# Altium project 电子脚铐手持式主控板.PrjPcb
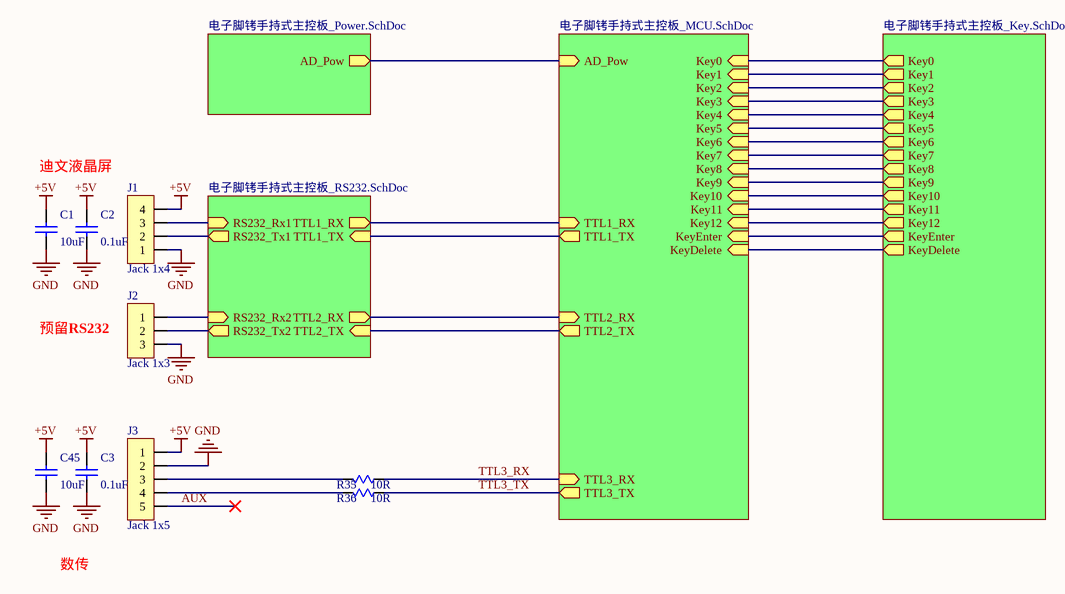
[diagram p0: 电子脚铐手持式主控板_Frame.SchDoc]
5 sheets, 124 parts. Net scope: hierarchical (ports join the sheet entries above them; power ports are global).
Board file: 电子脚铐手持式主控板V3.PcbDoc
Sheets:
  电子脚铐手持式主控板_Frame.SchDoc
    Designator = 电子脚铐手持式主控板_Power.SchDoc
    Designator = 电子脚铐手持式主控板_RS232.SchDoc
    Designator = 电子脚铐手持式主控板_Key.SchDoc
    Designator = 电子脚铐手持式主控板_MCU.SchDoc

## Sheet 电子脚铐手持式主控板_Frame.SchDoc
size A4

### Parts
C1  10uF  [C0603]
C2  0.1uF  [C0603]
C3  0.1uF  [C0603]
C45  10uF  [C0603]
J1  Jack 1x4  [XH-4AW]
J2  Jack 1x3  [XH-3AW]
J3  Jack 1x5  [PH-5A]
R35  10R  [R0603]
R36  10R  [R0603]

### Sub-sheets
Designator = 电子脚铐手持式主控板_Power.SchDoc: AD_Pow (out)
Designator = 电子脚铐手持式主控板_RS232.SchDoc: RS232_Tx1 (out), RS232_Rx1 (in), RS232_Rx2 (in), RS232_Tx2 (out), TTL1_RX (out), TTL2_RX (out), TTL1_TX (in), TTL2_TX (in)
Designator = 电子脚铐手持式主控板_Key.SchDoc: Key0 (out), Key1 (out), Key2 (out), Key3 (out), Key4 (out), Key5 (out), Key6 (out), Key7 (out), Key8 (out), Key9 (out), KeyEnter (out), KeyDelete (out), Key10 (out), Key11 (out), Key12 (out)
Designator = 电子脚铐手持式主控板_MCU.SchDoc: AD_Pow (in), TTL1_RX (in), TTL1_TX (out), TTL2_TX (out), TTL2_RX (in), Key0 (in), Key1 (in), Key2 (in), Key3 (in), Key4 (in), Key5 (in), Key6 (in), Key7 (in), Key8 (in), Key9 (in), KeyEnter (in), KeyDelete (in), TTL3_RX (in), TTL3_TX (out), Key10 (in), Key11 (in), Key12 (in)

### Nets
+5V: C1.1 C2.1 C3.1 C45.1 J1.4 J3.1
GND: C1.2 C2.2 C3.2 C45.2 J1.1 J2.3 J3.2
AD_Pow: sheet Designator/AD_Pow, sheet Designator/AD_Pow
AUX: J3.5
Key0: sheet Designator/Key0, sheet Designator/Key0
Key1: sheet Designator/Key1, sheet Designator/Key1
Key2: sheet Designator/Key2, sheet Designator/Key2
Key3: sheet Designator/Key3, sheet Designator/Key3
Key4: sheet Designator/Key4, sheet Designator/Key4
Key5: sheet Designator/Key5, sheet Designator/Key5
Key6: sheet Designator/Key6, sheet Designator/Key6
Key7: sheet Designator/Key7, sheet Designator/Key7
Key8: sheet Designator/Key8, sheet Designator/Key8
Key9: sheet Designator/Key9, sheet Designator/Key9
Key10: sheet Designator/Key10, sheet Designator/Key10
Key11: sheet Designator/Key11, sheet Designator/Key11
Key12: sheet Designator/Key12, sheet Designator/Key12
KeyDelete: sheet Designator/KeyDelete, sheet Designator/KeyDelete
KeyEnter: sheet Designator/KeyEnter, sheet Designator/KeyEnter
RS232_Rx1: J1.3 ; sheet Designator/RS232_Rx1
RS232_Rx2: J2.1 ; sheet Designator/RS232_Rx2
RS232_Tx1: J1.2 ; sheet Designator/RS232_Tx1
RS232_Tx2: J2.2 ; sheet Designator/RS232_Tx2
TTL1_RX: sheet Designator/TTL1_RX, sheet Designator/TTL1_RX
TTL1_TX: sheet Designator/TTL1_TX, sheet Designator/TTL1_TX
TTL2_RX: sheet Designator/TTL2_RX, sheet Designator/TTL2_RX
TTL2_TX: sheet Designator/TTL2_TX, sheet Designator/TTL2_TX
TTL3_RX: R35.2 ; sheet Designator/TTL3_RX
TTL3_TX: R36.2 ; sheet Designator/TTL3_TX
NetJ3_3: J3.3 R35.1
NetJ3_4: J3.4 R36.1

### Notes on the sheet
- 迪文液晶屏
- 预留RS232
- 数传
- 文件名:
- 审核:
- 制图人:
- 孟浩
- 校对:
- 图号:
- 批准:
- 日期:

### Library data of the parts
C1-C3 C45 = CAP: Published: 8-Jun-2000; LatestRevisionDate: 17-Jul-2002; LatestRevisionNote: Re-released for DXP Platform.; PackageReference: RAD-0.3; Publisher: Altium Limited
J1 = Jack 1x4: 插座
J2 = Jack 1x3: 插座
J3 = Jack 1x5: 插座
R35 R36 = Res: Resistor; Published: 8-Jun-2000; LatestRevisionDate: 04-Mar-2005; LatestRevisionNote: PCB Footprint replaced.; PackageReference: J1-0603; Publisher: Altium Limited

## Sheet 电子脚铐手持式主控板_Power.SchDoc
size A4
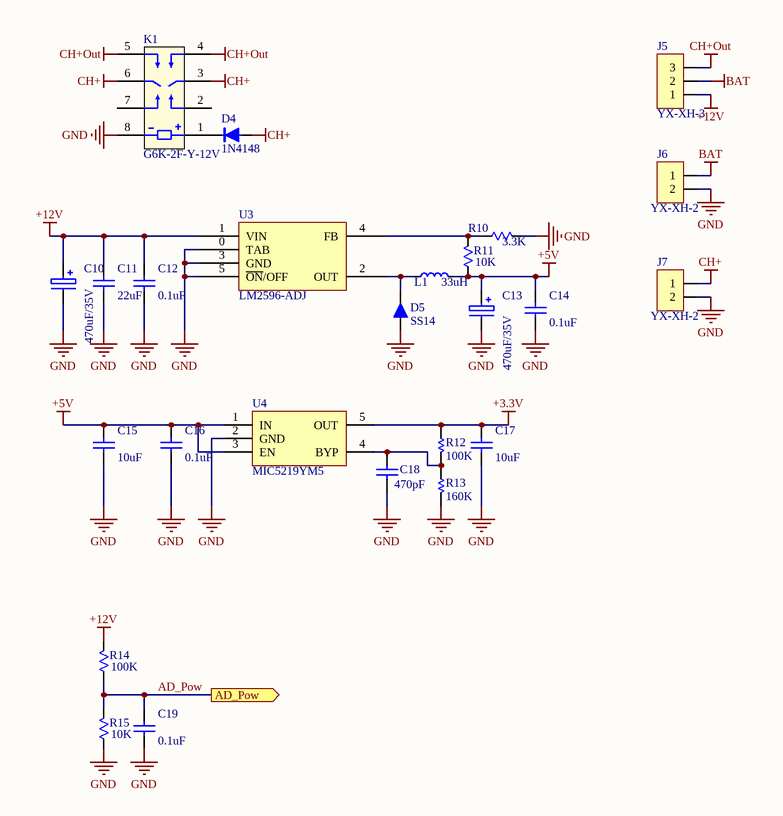
[diagram p1: 电子脚铐手持式主控板_Power.SchDoc]

### Parts
C10  470uF/35V  [C10*10.8]
C11  22uF  [C1210]
C12  0.1uF  [C0603]
C13  470uF/35V  [C10*10.8]
C14  0.1uF  [C0603]
C15  10uF  [C0603]
C16  0.1uF  [C0603]
C17  10uF  [C0603]
C18  470pF  [C0603]
C19  0.1uF  [C0603]
D4  1N4148  [SOD-80-S]
D5  SS14  [SMA]
J5  YX-XH-3  [YX-XH-3]
J6  YX-XH-2  [YX-XH-2]
J7  YX-XH-2  [YX-XH-2]
K1  G6K-2F-Y-12V  [G6K-2F-Y]
L1  33uH  [L10.5*11.5mm]
R10  3.3K  [R0603]
R11  10K  [R0603]
R12  100K  [R0603]
R13  160K  [R0603]
R14  100K  [R0603]
R15  10K  [R0603]
U3  LM2596-ADJ  [TO-263-5]
U4  MIC5219YM5  [SOT-23-5]

### Ports
AD_Pow (out)

### Nets
+3.3V: C17.1 R12.1 U4.5(OUT)
+5V: C13.1 C14.1 C15.1 C16.1 L1.2 R11.1 U4.1(IN) U4.3(EN)
+12V: C10.1 C11.1 C12.1 J5.1 R14.2 U3.1(VIN)
BAT: J5.2 J6.1
CH+: D4.1(A) J7.1 K1.3 K1.6
CH+Out: J5.3 K1.4 K1.5
GND: C10.2 C11.2 C12.2 C13.2 C14.2 C15.2 C16.2 C17.2 C18.2 C19.2 D5.1(A) J6.2 J7.2 K1.8 R10.2 R13.2 R15.1 U3.0(TAB) U3.3(GND) U3.5(~{ON}/OFF) U4.2(GND)
AD_Pow: C19.1 R14.1 R15.2 ; port AD_Pow
NetC18_1: C18.1 R12.2 R13.1 U4.4(BYP)
NetD4_2: D4.2(K) K1.1
NetD5_2: D5.2(K) L1.1 U3.2(OUT)
NetR10_1: R10.1 R11.2 U3.4(FB)

Not connected (* = marked no-connect by the designer): K1 2 7

### Notes on the sheet
- 文件名:
- 审核:
- 制图人:
- 孟浩
- 校对:
- 图号:
- 批准:
- 日期:

### Library data of the parts
C10 C13 = ELECTRO: Electrolytic Capacitor
C11 C12 C14-C19 = CAP: Published: 8-Jun-2000; LatestRevisionDate: 17-Jul-2002; LatestRevisionNote: Re-released for DXP Platform.; PackageReference: RAD-0.3; Publisher: Altium Limited
D4 = DIODE-SWITCHING: Silicon Epitaxial Planar Diodes
D5 = Diode 1N4148: High Conductance Fast Diode; Published: 8-Jun-2000; LatestRevisionDate: 17-Jul-2002; LatestRevisionNote: Re-released for DXP Platform.; DatasheetVersion: 1997; PackageReference: DO-35; Publisher: Altium Limited; PackageDescription: Diode, Axial; Body 3.8 x 1.9 mm (LxDia. max), Lead Dia. 0.53 mm (max); Code_JEDEC: DO-204-AH; ComponentLink1Description: Manufacturer Link; ComponentLink1URL: http://www.fairchildsemi.com/; ComponentLink2Description: Datasheet; ComponentLink2URL: http://www.fairchildsemi.com/ds/1N%2F1N4148.pdf
J5 = HEADER1X3
J6 J7 = Jack 1x2: 插座
K1 = G6K-2F-Y
L1 = INDUCTOR: Code_IEC: 1005; Published: 8-Jun-2000; LatestRevisionDate: 17-Jul-2002; LatestRevisionNote: Re-released for DXP Platform.; PackageReference: 0402-A; Publisher: Altium Limited; Code_JEITA: 0402
R10 R11 R14 R15 = RES: Resistor; Published: 8-Jun-2000; LatestRevisionDate: 17-Jul-2002; LatestRevisionNote: Re-released for DXP Platform.; PackageReference: AXIAL-0.3; Publisher: Altium Limited
R12 R13 = Res
U3 = LM25x6-5: LM2596-5;LM2576-5
U4 = MIC5205

## Sheet 电子脚铐手持式主控板_RS232.SchDoc
size A4
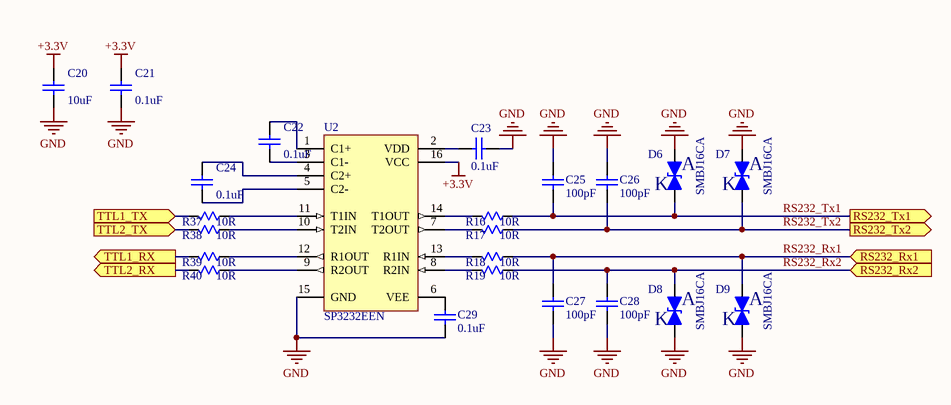
[diagram p2: 电子脚铐手持式主控板_RS232.SchDoc]

### Parts
C20  10uF  [C0603]
C21  0.1uF  [C0603]
C22  0.1uF  [C0603]
C23  0.1uF  [C0603]
C24  0.1uF  [C0603]
C25  100pF  [C0603]
C26  100pF  [C0603]
C27  100pF  [C0603]
C28  100pF  [C0603]
C29  0.1uF  [C0603]
D6  SMBJ16CA  [SMB]
D7  SMBJ16CA  [SMB]
D8  SMBJ16CA  [SMB]
D9  SMBJ16CA  [SMB]
R16  10R  [R0603]
R17  10R  [R0603]
R18  10R  [R0603]
R19  10R  [R0603]
R37  10R  [R0603]
R38  10R  [R0603]
R39  10R  [R0603]
R40  10R  [R0603]
U2  SP3232EEN  [SO16]

### Ports
RS232_Rx1 (in), RS232_Rx2 (in), RS232_Tx1 (out), RS232_Tx2 (out), TTL1_RX (out), TTL1_TX (in), TTL2_RX (out), TTL2_TX (in)

### Nets
+3.3V: C20.1 C21.1 U2.16(VCC)
GND: C20.2 C21.2 C23.1 C25.1 C26.1 C27.2 C28.2 C29.1 D6.1(A) D7.1(A) D8.2(K) D9.2(K) U2.15(GND)
RS232_Rx1: C27.1 D9.1(A) R18.2 ; port RS232_Rx1
RS232_Rx2: C28.1 D8.1(A) R19.2 ; port RS232_Rx2
RS232_Tx1: C25.2 D6.2(K) R16.2 ; port RS232_Tx1
RS232_Tx2: C26.2 D7.2(K) R17.2 ; port RS232_Tx2
TTL1_RX: R39.1 ; port TTL1_RX
TTL1_TX: R37.1 ; port TTL1_TX
TTL2_RX: R40.1 ; port TTL2_RX
TTL2_TX: R38.1 ; port TTL2_TX
NetC22_1: C22.1 U2.1(C1+)
NetC22_2: C22.2 U2.3(C1-)
NetC23_2: C23.2 U2.2(VDD)
NetC24_1: C24.1 U2.4(C2+)
NetC24_2: C24.2 U2.5(C2-)
NetC29_2: C29.2 U2.6(VEE)
NetR16_1: R16.1 U2.14(T1OUT)
NetR17_1: R17.1 U2.7(T2OUT)
NetR18_1: R18.1 U2.13(R1IN)
NetR19_1: R19.1 U2.8(R2IN)
NetR37_2: R37.2 U2.11(T1IN)
NetR38_2: R38.2 U2.10(T2IN)
NetR39_2: R39.2 U2.12(R1OUT)
NetR40_2: R40.2 U2.9(R2OUT)

### Notes on the sheet
- 文件名:
- 审核:
- 制图人:
- 孟浩
- 校对:
- 图号:
- 批准:
- 日期:

### Library data of the parts
C20-C29 = CAP: Published: 8-Jun-2000; LatestRevisionDate: 17-Jul-2002; LatestRevisionNote: Re-released for DXP Platform.; PackageReference: RAD-0.3; Publisher: Altium Limited
D6-D9 = BS0300N
R16-R19 R37-R40 = Res: Resistor; Published: 8-Jun-2000; LatestRevisionDate: 04-Mar-2005; LatestRevisionNote: PCB Footprint replaced.; PackageReference: J1-0603; Publisher: Altium Limited
U2 = MAX232ACPE: +5V Powered, Multi-Channel RS-232 Driver/Receiver; Manufacturer: Maxim; Class: Communication; SubClass: Transceiver; Published: 16/01/2001; Publisher: Altium Hobart Technology Centre

## Sheet 电子脚铐手持式主控板_Key.SchDoc
size A4
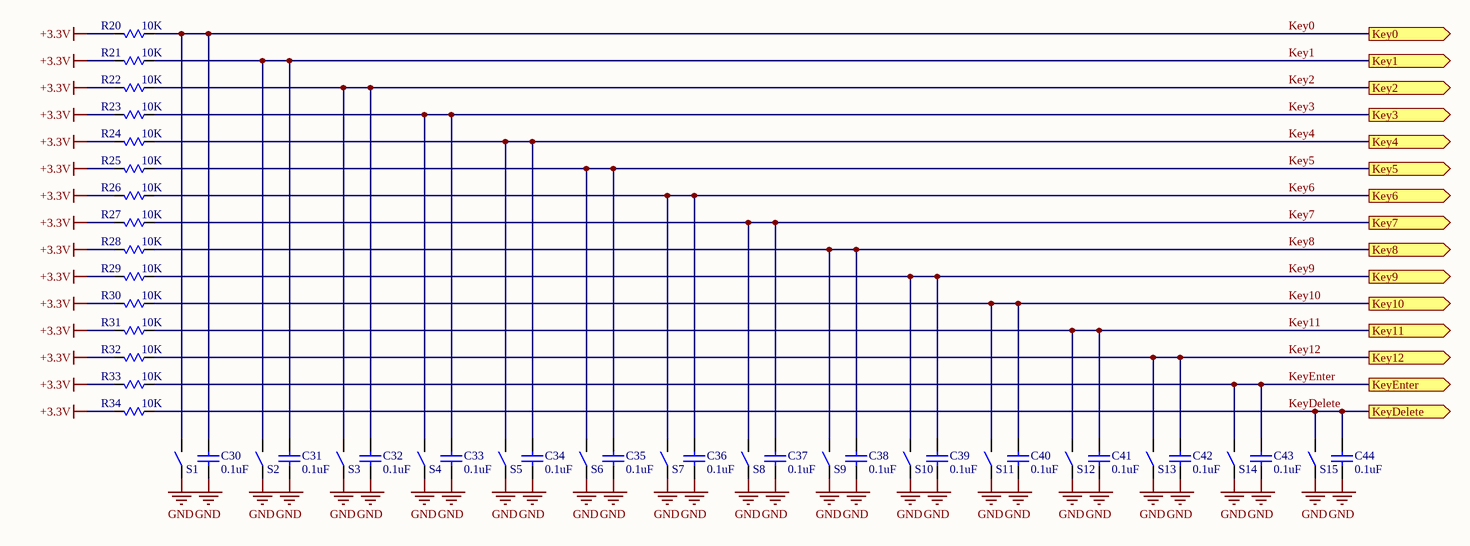
[diagram p3: 电子脚铐手持式主控板_Key.SchDoc]

### Parts
C30  0.1uF  [C0603]
C31  0.1uF  [C0603]
C32  0.1uF  [C0603]
C33  0.1uF  [C0603]
C34  0.1uF  [C0603]
C35  0.1uF  [C0603]
C36  0.1uF  [C0603]
C37  0.1uF  [C0603]
C38  0.1uF  [C0603]
C39  0.1uF  [C0603]
C40  0.1uF  [C0603]
C41  0.1uF  [C0603]
C42  0.1uF  [C0603]
C43  0.1uF  [C0603]
C44  0.1uF  [C0603]
R20  10K  [R0603]
R21  10K  [R0603]
R22  10K  [R0603]
R23  10K  [R0603]
R24  10K  [R0603]
R25  10K  [R0603]
R26  10K  [R0603]
R27  10K  [R0603]
R28  10K  [R0603]
R29  10K  [R0603]
R30  10K  [R0603]
R31  10K  [R0603]
R32  10K  [R0603]
R33  10K  [R0603]
R34  10K  [R0603]
S1  Switch  [B3F-4055]  (value not drawn)
S2  Switch  [B3F-4055]  (value not drawn)
S3  Switch  [B3F-4055]  (value not drawn)
S4  Switch  [B3F-4055]  (value not drawn)
S5  Switch  [B3F-4055]  (value not drawn)
S6  Switch  [B3F-4055]  (value not drawn)
S7  Switch  [B3F-4055]  (value not drawn)
S8  Switch  [B3F-4055]  (value not drawn)
S9  Switch  [B3F-4055]  (value not drawn)
S10  Switch  [B3F-4055]  (value not drawn)
S11  Switch  [B3F-4055]  (value not drawn)
S12  Switch  [B3F-4055]  (value not drawn)
S13  Switch  [B3F-4055]  (value not drawn)
S14  Switch  [B3F-4055]  (value not drawn)
S15  Switch  [B3F-4055]  (value not drawn)

### Ports
Key0 (out), Key1 (out), Key2 (out), Key3 (out), Key4 (out), Key5 (out), Key6 (out), Key7 (out), Key8 (out), Key9 (out), Key10 (out), Key11 (out), Key12 (out), KeyDelete (out), KeyEnter (out)

### Nets
+3.3V: R20.2 R21.2 R22.2 R23.2 R24.2 R25.2 R26.2 R27.2 R28.2 R29.2 R30.2 R31.2 R32.2 R33.2 R34.2
GND: C30.2 C31.2 C32.2 C33.2 C34.2 C35.2 C36.2 C37.2 C38.2 C39.2 C40.2 C41.2 C42.2 C43.2 C44.2 S1.1 S2.1 S3.1 S4.1 S5.1 S6.1 S7.1 S8.1 S9.1 S10.1 S11.1 S12.1 S13.1 S14.1 S15.1
Key0: C30.1 R20.1 S1.2 ; port Key0
Key1: C31.1 R21.1 S2.2 ; port Key1
Key2: C32.1 R22.1 S3.2 ; port Key2
Key3: C33.1 R23.1 S4.2 ; port Key3
Key4: C34.1 R24.1 S5.2 ; port Key4
Key5: C35.1 R25.1 S6.2 ; port Key5
Key6: C36.1 R26.1 S7.2 ; port Key6
Key7: C37.1 R27.1 S8.2 ; port Key7
Key8: C38.1 R28.1 S9.2 ; port Key8
Key9: C39.1 R29.1 S10.2 ; port Key9
Key10: C40.1 R30.1 S11.2 ; port Key10
Key11: C41.1 R31.1 S12.2 ; port Key11
Key12: C42.1 R32.1 S13.2 ; port Key12
KeyDelete: C44.1 R34.1 S15.2 ; port KeyDelete
KeyEnter: C43.1 R33.1 S14.2 ; port KeyEnter

### Notes on the sheet
- 文件名:
- 审核:
- 制图人:
- 孟浩
- 校对:
- 图号:
- 批准:
- 日期:

### Library data of the parts
C30-C44 = Cap: Capacitor; Published: 8-Jun-2000; Revision: July-2002: Re-released for DXP Platform.; Publisher: Altium Limited
R20-R34 = RES: Resistor; Published: 8-Jun-2000; LatestRevisionDate: 17-Jul-2002; LatestRevisionNote: Re-released for DXP Platform.; PackageReference: AXIAL-0.3; Publisher: Altium Limited
S1-S15 = Sw

## Sheet 电子脚铐手持式主控板_MCU.SchDoc
size A4
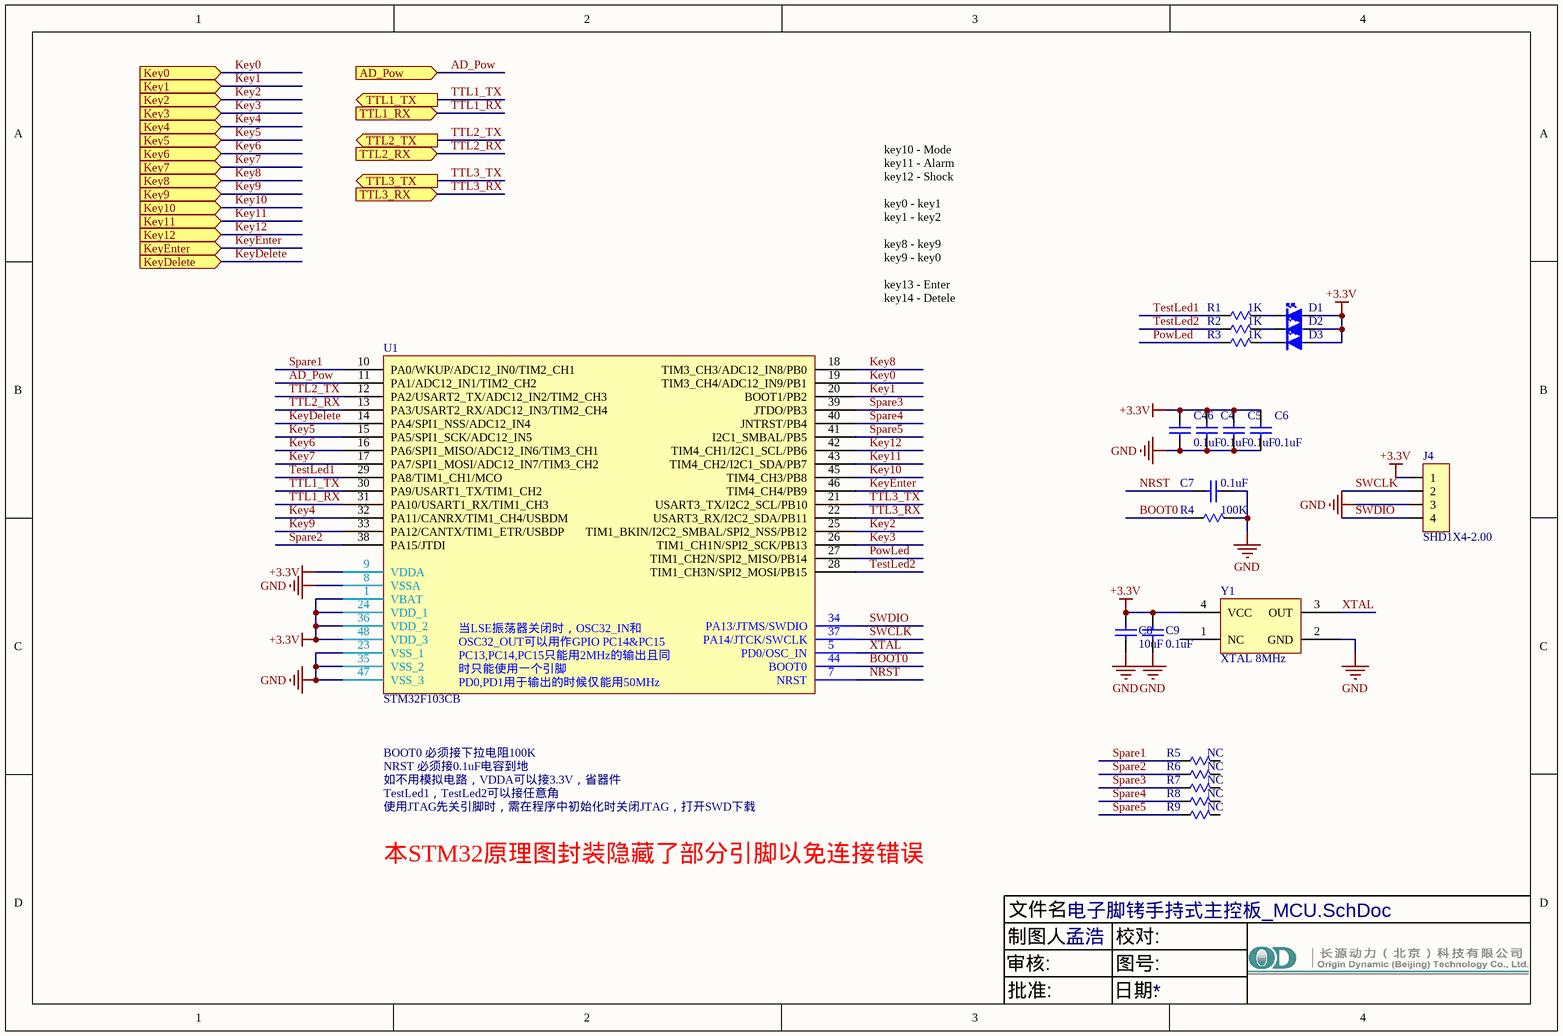
[diagram p4: 电子脚铐手持式主控板_MCU.SchDoc]

### Parts
C4  0.1uF  [C0603]
C5  0.1uF  [C0603]
C6  0.1uF  [C0603]
C7  0.1uF  [C0603]
C8  10uF  [C0603]
C9  0.1uF  [C0603]
C46  0.1uF  [C0603]
D1  LED  [LED0805]  (value not drawn)
D2  LED  [LED0805]  (value not drawn)
D3  LED  [LED0805]  (value not drawn)
J4  SHD1X4-2.00  [Jk1*4-2.0]
R1  1K  [R0603]
R2  1K  [R0603]
R3  1K  [R0603]
R4  100K  [R0603]
R5  NC  [R0603]
R6  NC  [R0603]
R7  NC  [R0603]
R8  NC  [R0603]
R9  NC  [R0603]
U1  STM32F103CB  [LQFP48]
Y1  XTAL 8MHz  [XTAL5032]

### Ports
AD_Pow (in), Key0 (in), Key1 (in), Key2 (in), Key3 (in), Key4 (in), Key5 (in), Key6 (in), Key7 (in), Key8 (in), Key9 (in), Key10 (in), Key11 (in), Key12 (in), KeyDelete (in), KeyEnter (in), TTL1_RX (in), TTL1_TX (out), TTL2_RX (in), TTL2_TX (out), TTL3_RX (in), TTL3_TX (out)

### Nets
+3.3V: C4.1 C5.1 C6.1 C8.2 C9.2 C46.1 D1.1(A) D2.1(A) D3.1(A) J4.1 U1.1(VBAT) U1.9(VDDA) U1.24(VDD_1) U1.36(VDD_2) U1.48(VDD_3) Y1.4(VCC)
GND: C4.2 C5.2 C6.2 C7.2 C8.1 C9.1 C46.2 J4.3 R4.2 U1.8(VSSA) U1.23(VSS_1) U1.35(VSS_2) U1.47(VSS_3) Y1.2(GND)
AD_Pow: U1.11(PA1/ADC12_IN1/TIM2_CH2) ; port AD_Pow
BOOT0: R4.1 U1.44(BOOT0)
Key0: U1.19(TIM3_CH4/ADC12_IN9/PB1) ; port Key0
Key1: U1.20(BOOT1/PB2) ; port Key1
Key2: U1.25(TIM1_BKIN/I2C2_SMBAL/SPI2_NSS/PB12) ; port Key2
Key3: U1.26(TIM1_CH1N/SPI2_SCK/PB13) ; port Key3
Key4: U1.32(PA11/CANRX/TIM1_CH4/USBDM) ; port Key4
Key5: U1.15(PA5/SPI1_SCK/ADC12_IN5) ; port Key5
Key6: U1.16(PA6/SPI1_MISO/ADC12_IN6/TIM3_CH1) ; port Key6
Key7: U1.17(PA7/SPI1_MOSI/ADC12_IN7/TIM3_CH2) ; port Key7
Key8: U1.18(TIM3_CH3/ADC12_IN8/PB0) ; port Key8
Key9: U1.33(PA12/CANTX/TIM1_ETR/USBDP) ; port Key9
Key10: U1.45(TIM4_CH3/PB8) ; port Key10
Key11: U1.43(TIM4_CH2/I2C1_SDA/PB7) ; port Key11
Key12: U1.42(TIM4_CH1/I2C1_SCL/PB6) ; port Key12
KeyDelete: U1.14(PA4/SPI1_NSS/ADC12_IN4) ; port KeyDelete
KeyEnter: U1.46(TIM4_CH4/PB9) ; port KeyEnter
NRST: C7.1 U1.7(NRST)
PowLed: R3.1 U1.27(TIM1_CH2N/SPI2_MISO/PB14)
Spare1: R5.1 U1.10(PA0/WKUP/ADC12_IN0/TIM2_CH1)
Spare2: R6.1 U1.38(PA15/JTDI)
Spare3: R7.1 U1.39(JTDO/PB3)
Spare4: R8.1 U1.40(JNTRST/PB4)
Spare5: R9.1 U1.41(I2C1_SMBAL/PB5)
SWCLK: J4.2 U1.37(PA14/JTCK/SWCLK)
SWDIO: J4.4 U1.34(PA13/JTMS/SWDIO)
TestLed1: R1.1 U1.29(PA8/TIM1_CH1/MCO)
TestLed2: R2.1 U1.28(TIM1_CH3N/SPI2_MOSI/PB15)
TTL1_RX: U1.31(PA10/USART1_RX/TIM1_CH3) ; port TTL1_RX
TTL1_TX: U1.30(PA9/USART1_TX/TIM1_CH2) ; port TTL1_TX
TTL2_RX: U1.13(PA3/USART2_RX/ADC12_IN3/TIM2_CH4) ; port TTL2_RX
TTL2_TX: U1.12(PA2/USART2_TX/ADC12_IN2/TIM2_CH3) ; port TTL2_TX
TTL3_RX: U1.22(USART3_RX/I2C2_SDA/PB11) ; port TTL3_RX
TTL3_TX: U1.21(USART3_TX/I2C2_SCL/PB10) ; port TTL3_TX
XTAL: U1.5(PD0/OSC_IN) Y1.3(OUT)
NetD1_2: D1.2(K) R1.2
NetD2_2: D2.2(K) R2.2
NetD3_2: D3.2(K) R3.2

Not connected (* = marked no-connect by the designer): R5 2; R6 2; R7 2; R8 2; R9 2; U1 2(PC13-TAMPER-RTC) 3(PC14-OSC32_IN) 4(PC15-OSC32_OUT) 6(PD1/OSC_OUT); Y1 1(NC)

### Notes on the sheet
- key10 - Mode
  key11 - Alarm
  key12 - Shock
  key0 - key1
  key1 - key2
  key8 - key9
  key9 - key0
  key13 - Enter
  key14 - Detele
- BOOT0 必须接下拉电阻100K
- NRST 必须接0.1uF电容到地
- 如不用模拟电路，VDDA可以接3.3V，省器件
- TestLed1，TestLed2可以接任意角
- 使用JTAG先关引脚时，需在程序中初始化时关闭JTAG，打开SWD下载
- 本STM32原理图封装隐藏了部分引脚以免连接错误
- 文件名:
- 审核:
- 制图人:
- 孟浩
- 校对:
- 图号:
- 批准:
- 日期:
- (in symbol STM32F103Cx) OSC32_IN和OSC32_OUT可以用作通用IO PC14和PC15; PC13,PC14,PC15只能用于2MHz的输出模式且同时只能使用一个引脚; 当LSE振荡器关闭时，OSC32_IN和OSC32_OUT可以用作GPIO PC14&PC15 / PC13,PC14,PC15只能用2MHz的输出且同时只能使用一个引脚 / PD0,PD1用于输出的时候仅能用50MHz

### Library data of the parts
C4-C9 C46 = CAP: Published: 8-Jun-2000; LatestRevisionDate: 17-Jul-2002; LatestRevisionNote: Re-released for DXP Platform.; PackageReference: RAD-0.3; Publisher: Altium Limited
J4 = HEADER1X4
R1-R9 = RES: Resistor; Published: 8-Jun-2000; LatestRevisionDate: 17-Jul-2002; LatestRevisionNote: Re-released for DXP Platform.; PackageReference: AXIAL-0.3; Publisher: Altium Limited
U1 = STM32F103Cx
Y1 = XTAL

## Nets that join several sheets
+3.3V: 电子脚铐手持式主控板_Power (C17.1 R12.1 U4.5), 电子脚铐手持式主控板_RS232 (C20.1 C21.1 U2.16), 电子脚铐手持式主控板_Key (15 pins), 电子脚铐手持式主控板_MCU (16 pins)
+5V: 电子脚铐手持式主控板_Frame (6 pins), 电子脚铐手持式主控板_Power (8 pins)
GND: 电子脚铐手持式主控板_Frame (7 pins), 电子脚铐手持式主控板_Power (21 pins), 电子脚铐手持式主控板_RS232 (13 pins), 电子脚铐手持式主控板_Key (30 pins), 电子脚铐手持式主控板_MCU (14 pins)
AD_Pow: 电子脚铐手持式主控板_Power (C19.1 R14.1 R15.2), 电子脚铐手持式主控板_MCU (U1.11)
Key0: 电子脚铐手持式主控板_Key (C30.1 R20.1 S1.2), 电子脚铐手持式主控板_MCU (U1.19)
Key1: 电子脚铐手持式主控板_Key (C31.1 R21.1 S2.2), 电子脚铐手持式主控板_MCU (U1.20)
Key2: 电子脚铐手持式主控板_Key (C32.1 R22.1 S3.2), 电子脚铐手持式主控板_MCU (U1.25)
Key3: 电子脚铐手持式主控板_Key (C33.1 R23.1 S4.2), 电子脚铐手持式主控板_MCU (U1.26)
Key4: 电子脚铐手持式主控板_Key (C34.1 R24.1 S5.2), 电子脚铐手持式主控板_MCU (U1.32)
Key5: 电子脚铐手持式主控板_Key (C35.1 R25.1 S6.2), 电子脚铐手持式主控板_MCU (U1.15)
Key6: 电子脚铐手持式主控板_Key (C36.1 R26.1 S7.2), 电子脚铐手持式主控板_MCU (U1.16)
Key7: 电子脚铐手持式主控板_Key (C37.1 R27.1 S8.2), 电子脚铐手持式主控板_MCU (U1.17)
Key8: 电子脚铐手持式主控板_Key (C38.1 R28.1 S9.2), 电子脚铐手持式主控板_MCU (U1.18)
Key9: 电子脚铐手持式主控板_Key (C39.1 R29.1 S10.2), 电子脚铐手持式主控板_MCU (U1.33)
Key10: 电子脚铐手持式主控板_Key (C40.1 R30.1 S11.2), 电子脚铐手持式主控板_MCU (U1.45)
Key11: 电子脚铐手持式主控板_Key (C41.1 R31.1 S12.2), 电子脚铐手持式主控板_MCU (U1.43)
Key12: 电子脚铐手持式主控板_Key (C42.1 R32.1 S13.2), 电子脚铐手持式主控板_MCU (U1.42)
KeyDelete: 电子脚铐手持式主控板_Key (C44.1 R34.1 S15.2), 电子脚铐手持式主控板_MCU (U1.14)
KeyEnter: 电子脚铐手持式主控板_Key (C43.1 R33.1 S14.2), 电子脚铐手持式主控板_MCU (U1.46)
RS232_Rx1: 电子脚铐手持式主控板_Frame (J1.3), 电子脚铐手持式主控板_RS232 (C27.1 D9.1 R18.2)
RS232_Rx2: 电子脚铐手持式主控板_Frame (J2.1), 电子脚铐手持式主控板_RS232 (C28.1 D8.1 R19.2)
RS232_Tx1: 电子脚铐手持式主控板_Frame (J1.2), 电子脚铐手持式主控板_RS232 (C25.2 D6.2 R16.2)
RS232_Tx2: 电子脚铐手持式主控板_Frame (J2.2), 电子脚铐手持式主控板_RS232 (C26.2 D7.2 R17.2)
TTL1_RX: 电子脚铐手持式主控板_RS232 (R39.1), 电子脚铐手持式主控板_MCU (U1.31)
TTL1_TX: 电子脚铐手持式主控板_RS232 (R37.1), 电子脚铐手持式主控板_MCU (U1.30)
TTL2_RX: 电子脚铐手持式主控板_RS232 (R40.1), 电子脚铐手持式主控板_MCU (U1.13)
TTL2_TX: 电子脚铐手持式主控板_RS232 (R38.1), 电子脚铐手持式主控板_MCU (U1.12)
TTL3_RX: 电子脚铐手持式主控板_Frame (R35.2), 电子脚铐手持式主控板_MCU (U1.22)
TTL3_TX: 电子脚铐手持式主控板_Frame (R36.2), 电子脚铐手持式主控板_MCU (U1.21)